# EAGLE design lilygo-surf-v1 (EAGLE 9.6.2)
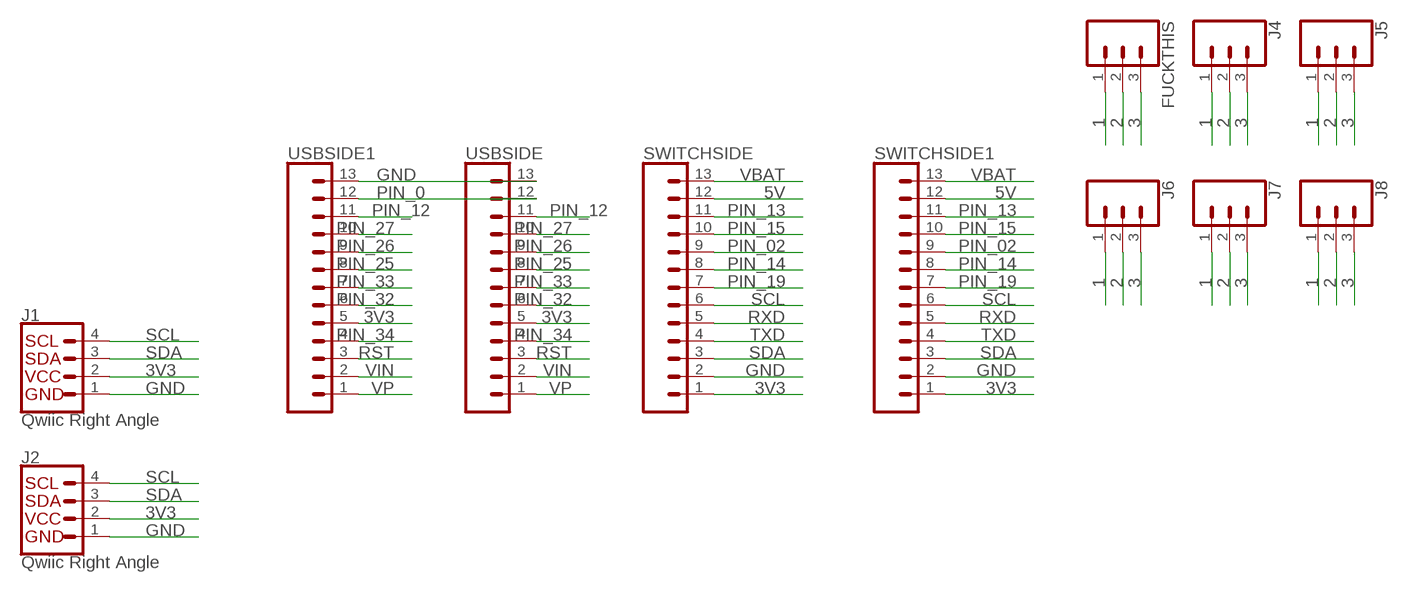
[diagram p0: schematic, sheet 1]

## Parts
FUCKTHIS  CONN_03  [1X03]
J1  Qwiic Right Angle  I2C_STANDARDQWIIC  [1X04_1MM_RA]
J2  Qwiic Right Angle  I2C_STANDARDQWIIC  [1X04_1MM_RA]
J4  CONN_03  [1X03]
J5  CONN_03  [1X03]
J6  CONN_03  [1X03]
J7  CONN_03  [1X03]
J8  CONN_03  [1X03]
SWITCHSIDE  CONN_13LOCK  [1X13_LOCK]
SWITCHSIDE1  CONN_13LOCK  [1X13_LOCK]
USBSIDE  CONN_13LOCK  [1X13_LOCK]
USBSIDE1  CONN_13LOCK  [1X13_LOCK]

## Nets
1: FUCKTHIS.1 J4.1 J5.1 J6.1 J7.1 J8.1
2: FUCKTHIS.2 J4.2 J5.2 J6.2 J7.2 J8.2
3: FUCKTHIS.3 J4.3 J5.3 J6.3 J7.3 J8.3
3V3: J1.2 J2.2 SWITCHSIDE1.1 SWITCHSIDE.1 USBSIDE1.5 USBSIDE.5
5V: SWITCHSIDE1.12 SWITCHSIDE.12
GND: J1.1 J2.1 SWITCHSIDE1.2 SWITCHSIDE.2 USBSIDE1.13 USBSIDE.13
PIN_0: USBSIDE1.12 USBSIDE.12
PIN_02: SWITCHSIDE1.9 SWITCHSIDE.9
PIN_12: USBSIDE1.11 USBSIDE.11
PIN_13: SWITCHSIDE1.11 SWITCHSIDE.11
PIN_14: SWITCHSIDE1.8 SWITCHSIDE.8
PIN_15: SWITCHSIDE1.10 SWITCHSIDE.10
PIN_19: SWITCHSIDE1.7 SWITCHSIDE.7
PIN_25: USBSIDE1.8 USBSIDE.8
PIN_26: USBSIDE1.9 USBSIDE.9
PIN_27: USBSIDE1.10 USBSIDE.10
PIN_32: USBSIDE1.6 USBSIDE.6
PIN_33: USBSIDE1.7 USBSIDE.7
PIN_34: USBSIDE1.4 USBSIDE.4
RST: USBSIDE1.3 USBSIDE.3
RXD: SWITCHSIDE1.5 SWITCHSIDE.5
SCL: J1.4 J2.4 SWITCHSIDE1.6 SWITCHSIDE.6
SDA: J1.3 J2.3 SWITCHSIDE1.3 SWITCHSIDE.3
TXD: SWITCHSIDE1.4 SWITCHSIDE.4
VBAT: SWITCHSIDE1.13 SWITCHSIDE.13
VIN: USBSIDE1.2 USBSIDE.2
VP: USBSIDE1.1 USBSIDE.1

## Library data of the parts
FUCKTHIS J4-J8 = SparkFun-Connectors:CONN_03: Multi connection point. Often used as Generic Header-pin footprint for 0.1 inch spaced/style header connections On any of the 0.1 inch spaced packages, you can populate with these: Break Away Headers - Straight <https://www.sparkfun.com/products/116> (PRT-00116) Break Away Male Headers - Right Angle <https://www.sparkfun.com/products/553> (PRT-00553) Female Headers <https://www.sparkfun.com/products/115> (PRT-00115) Break Away Headers - Machine Pin <https://www.sparkfun.com/products/117> (PRT-00117) Break Away Female Headers - Swiss Machine Pin <https://www.sparkfun.com/products/743> (PRT-00743) Stackable Header - 3 Pin (Female, 0.1") <https://www.sparkfun.com/products/13875> (PRT-13875) For SCREWTERMINALS and SPRING TERMINALS visit here: Screw Terimnals on SparkFun.com <https://www.sparkfun.com/search/results?term=Screw+Terminals> (5mm/3.5mm/2.54mm spacing) This device is also useful as a general connection point to wire up your design to another part of your project. Our various solder wires solder well into these plated through hole pads. Hook-Up Wire - Assortment (Stranded, 22 AWG) <https://www.sparkfun.com/products/11375> (PRT-11375) Hook-Up Wire - Assortment (Solid Core, 22 AWG) <https://www.sparkfun.com/products/11367> (PRT-11367) View the entire wire category on our website here <https://www.sparkfun.com/categories/141> Special notes: Molex polarized connector foot print use with SKU : PRT-08232 with associated crimp pins and housings.
J1 J2 = SparkFun-Connectors:I2C_STANDARD: SparkFun I2C Standard Pinout Header SparkFun has standardized on a pinout for all I2C based sensor breakouts. This pinout allows I2C boards to be plugged directly into the headers on Arduino Uno compatible boards, and to be daisy chained easily. Example SparkFun Products: SparkFun Atmospheric Sensor Breakout - BME280 <https://www.sparkfun.com/products/13676> SparkFun Altitude/Pressure Sensor Breakout - MPL3115A2 <https://www.sparkfun.com/products/11084> SparkFun TOF Range Finder Sensor - VL6180 <https://www.sparkfun.com/products/12785>; PROD_ID: CONN-13729
SWITCHSIDE SWITCHSIDE1 USBSIDE USBSIDE1 = SparkFun-Connectors:CONN_13: Multi connection point. Often used as Generic Header-pin footprint for 0.1 inch spaced/style header connections On any of the 0.1 inch spaced packages, you can populate with these: Break Away Headers - Straight <https://www.sparkfun.com/products/116> (PRT-00116) Break Away Male Headers - Right Angle <https://www.sparkfun.com/products/553> (PRT-00553) Female Headers <https://www.sparkfun.com/products/115> (PRT-00115) Break Away Headers - Machine Pin <https://www.sparkfun.com/products/117> (PRT-00117) Break Away Female Headers - Swiss Machine Pin <https://www.sparkfun.com/products/743> (PRT-00743) For SCREWTERMINALS and SPRING TERMINALS visit here: Screw Terimnals on SparkFun.com <https://www.sparkfun.com/search/results?term=Screw+Terminals> (5mm/3.5mm/2.54mm spacing) This device is also useful as a general connection point to wire up your design to another part of your project. Our various solder wires solder well into these plated through hole pads. Hook-Up Wire - Assortment (Stranded, 22 AWG) <https://www.sparkfun.com/products/11375> (PRT-11375) Hook-Up Wire - Assortment (Solid Core, 22 AWG) <https://www.sparkfun.com/products/11367> (PRT-11367) View the entire wire category on our website here <https://www.sparkfun.com/categories/141> Special notes: Molex polarized connector foot print use with SKU : PRT-08231 with associated crimp pins and housings. 1MM SMD Version SKU: PRT-10208 NOTES ON THE VARIANTS LOCK and LOCK_LONGPADS... This footprint was designed to help hold the alignment of a through-hole component (i.e. 6-pin header) while soldering it into place. You may notice that each hole has been shifted either up or down by 0.005 of an inch from it's more standard position (which is a perfectly straight line). This slight alteration caused the pins (the squares in the middle) to touch the edges of the holes. Because they are alternating, it causes a "brace" to hold the component in place. 0.005 has proven to be the perfect amount of "off-center" position when using our standard breakaway headers. Although looks a little odd when you look at the bare footprint, once you have a header in there, the alteration is very hard to notice. Also,if you push a header all the way into place, it is covered up entirely on the bottom side.

## Board
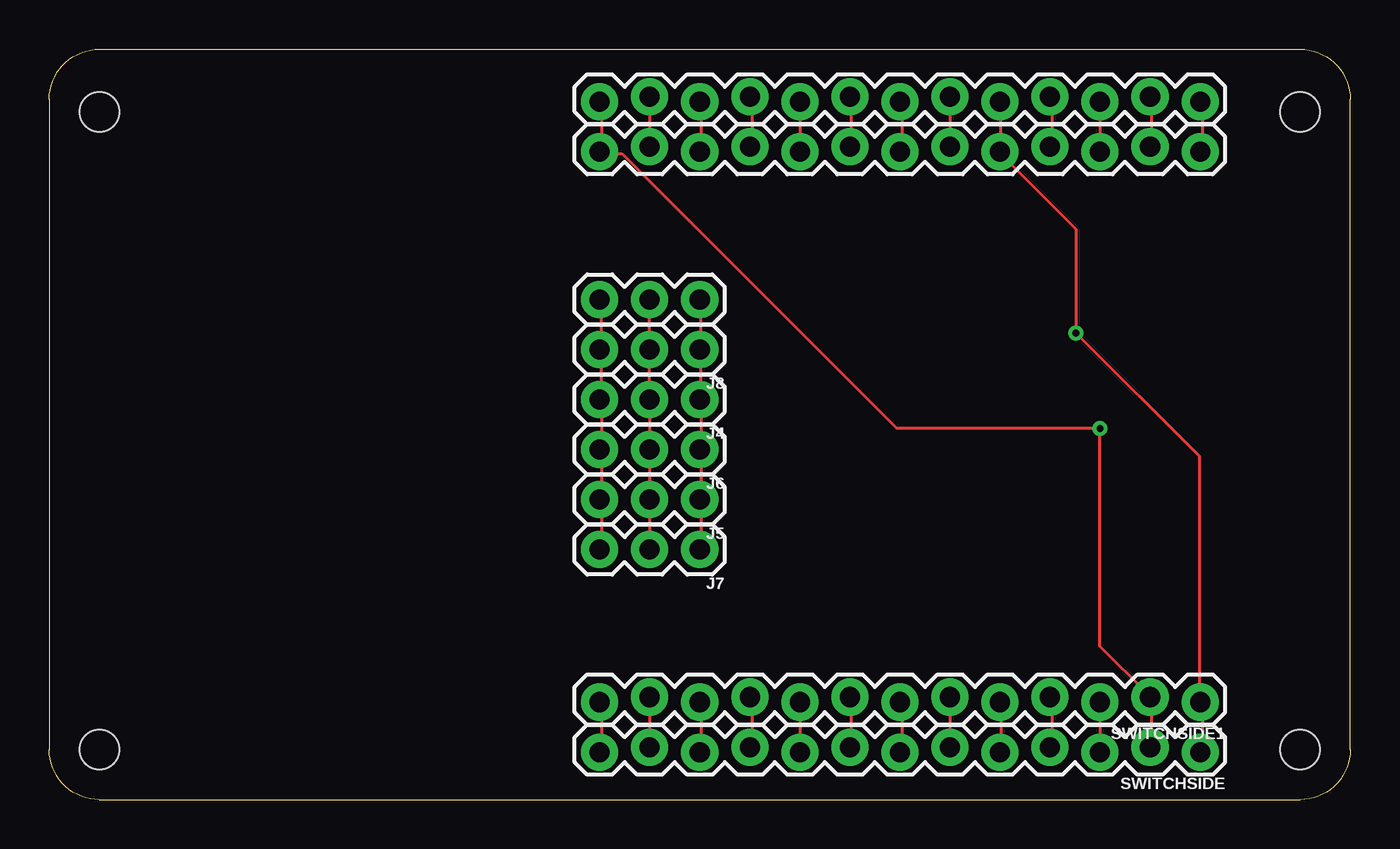
[diagram p1: board, top side]
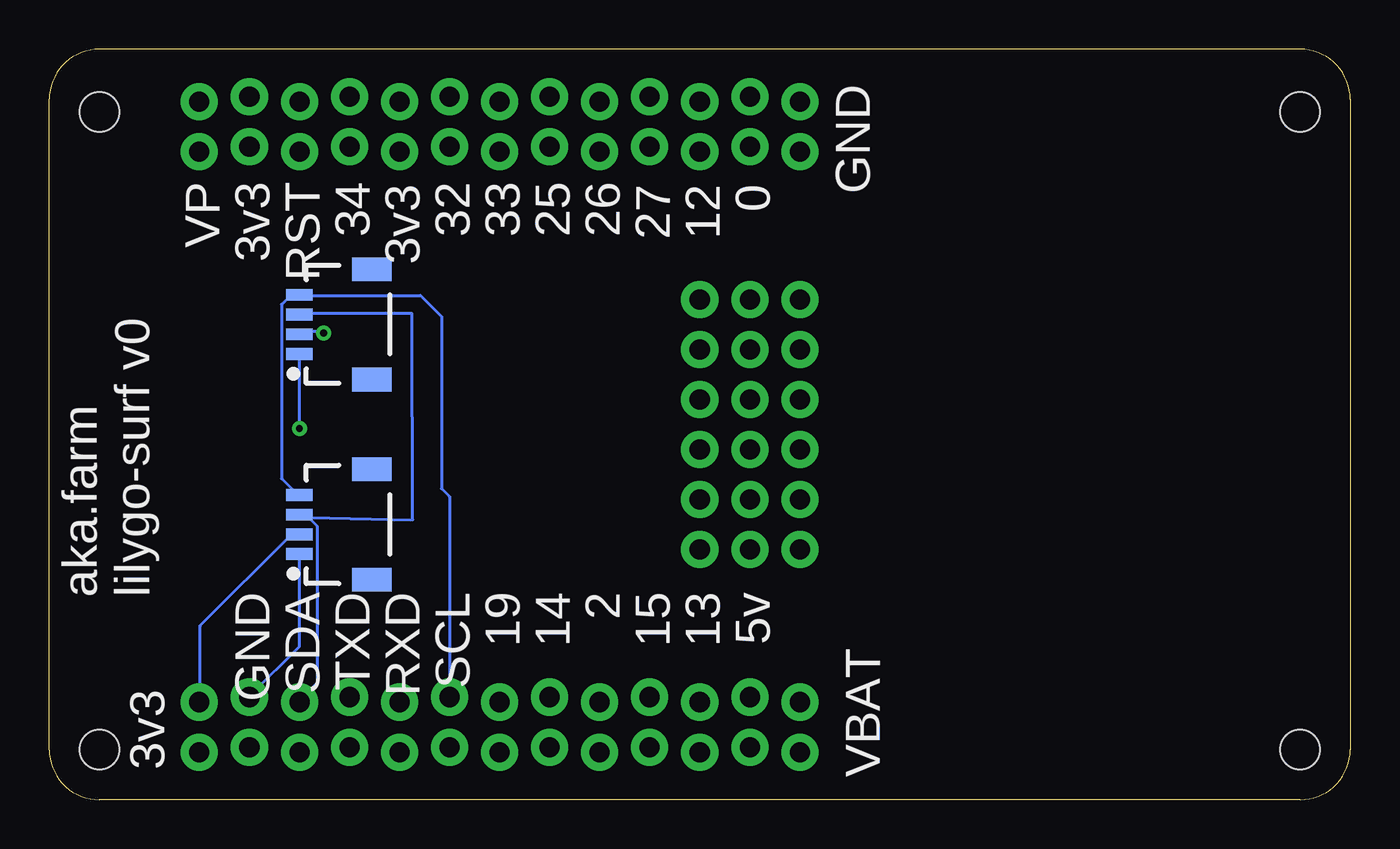
[diagram p2: board, bottom side, seen from below]

Size 66.04 x 38.1 mm. Coordinates in mm from the lower left corner, seen from the top.
Outline: 2.54,0 63.5,0 arc90 66.04,2.54 66.04,35.56 arc90 63.5,38.1 2.54,38.1 arc90 0,35.56 0,2.54 arc90 2.54,0
Copper layers (1*16): Top 0.035mm / dielectric 1.5mm / Bottom 0.035mm
Design rules "default": minimum track width 6mil, minimum drill 0.35mm, track to track 6mil, track to pad 6mil, pad to pad 6mil, via to via 6mil, smd to smd 6mil, copper to edge 40mil, drill to drill 6mil, minimum pad ring 10mil, minimum via ring 8mil, stop-mask expansion 4mil, vias tented up to drill 0mil, thermal gap 10mil
Holes 2 mm at 2.54,2.54 63.5,2.54 63.5,34.92 2.54,34.92

### Footprints (pad centres in the part's own frame; a part is rotated, then mirrored left to right if it is on the bottom)
1X03 = drill 1.016 pad 1.88: 1 0,0; 2 2.54,0; 3 5.08,0
1X04_1MM_RA = smd 0.6 x 1.35: 1 -1.5,0; 2 -0.5,0; 3 0.5,0; 4 1.5,0 | smd 1.2 x 2: NC1 2.8,-3.675; NC2 -2.8,-3.675
1X13_LOCK = drill 1.016 pad 1.88: 1 0,0.127; 2 2.54,-0.127; 3 5.08,0.127; 4 7.62,-0.127; 5 10.16,0.127; 6 12.7,-0.127; 7 15.24,0.127; 8 17.78,-0.127; 9 20.32,0.127; 10 22.86,-0.127; 11 25.4,0.127; 12 27.94,-0.127; 13 30.48,0.127

### Placement (x,y rotation side)
FUCKTHIS  33.02,25.4 180 top
J1  53.34,24.13 90 bottom
J2  53.34,13.97 90 bottom
J4  33.02,20.32 180 top
J5  33.02,15.24 180 top
J6  33.02,17.78 180 top
J7  33.02,12.7 180 top
J8  33.02,22.86 180 top
SWITCHSIDE  58.42,2.54 180 top
SWITCHSIDE1  58.42,5.08 180 top
USBSIDE  58.42,35.56 180 top
USBSIDE1  58.42,33.02 180 top

### Tracks (layer width: path | path; a pad name or v marks a point on that pad's centre or on a via)
1
  Top 0.152: J7.1 33.07,12.75 33.07,15.19 J5.1 33.07,15.34 33.07,17.78 | 33.07,17.78 33.07,20.22 J4.1 33.07,20.37 33.07,22.81 J8.1 33.07,22.96 33.07,25.4 FUCKTHIS.1 | 33.07,17.78 J6.1
2
  Top 0.152: J7.2 J5.2 J6.2 J4.2 J8.2 FUCKTHIS.2
3
  Top 0.152: J7.3 28.04,12.75 28.04,15.19 J5.3 28.04,15.34 28.04,17.78 | 28.04,17.78 28.04,20.22 J4.3 28.04,20.37 28.04,22.81 J8.3 28.04,22.96 28.04,25.4 FUCKTHIS.3 | 28.04,17.78 J6.3
3V3  (via drill 0.35)
  Top 0.152: SWITCHSIDE.1 58.52,2.44 58.52,4.88 SWITCHSIDE1.1 58.37,5.03 58.37,17.45 v52.12,23.7 52.12,28.96 48.31,32.77 USBSIDE1.5 48.31,32.92 48.31,35.36 USBSIDE.5
  Bottom 0.152: J2.2 53.34,13.41 53.8,13.41 58.37,8.84 58.37,5.03 SWITCHSIDE1.1 | v52.12,23.7 52.2,23.77 53.34,23.77 J1.2
5V
  Top 0.152: SWITCHSIDE1.12 SWITCHSIDE.12
GND  (via drill 0.35)
  Top 0.152: USBSIDE.13 28.04,35.36 28.04,32.92 USBSIDE1.13 28.04,32.77 29.11,32.77 43.03,18.85 v53.34,18.85 53.34,7.77 55.78,5.33 SWITCHSIDE1.2 55.93,5.18 55.93,2.74 SWITCHSIDE.2
  Bottom 0.152: J2.1 53.34,7.77 55.78,5.33 SWITCHSIDE1.2 | v53.34,18.85 J1.1
PIN_0
  Top 0.152: USBSIDE.12 USBSIDE1.12
PIN_02
  Top 0.152: SWITCHSIDE1.9 SWITCHSIDE.9
PIN_12
  Top 0.152: USBSIDE1.11 33.07,32.92 33.07,35.36 USBSIDE.11
PIN_13
  Top 0.152: SWITCHSIDE.11 33.07,2.44 33.07,4.88 SWITCHSIDE1.11
PIN_14
  Top 0.152: SWITCHSIDE.8 40.69,2.74 40.69,5.18 SWITCHSIDE1.8
PIN_15
  Top 0.152: SWITCHSIDE.10 35.66,2.74 35.66,5.18 SWITCHSIDE1.10
PIN_19
  Top 0.152: SWITCHSIDE.7 43.28,2.44 43.28,4.88 SWITCHSIDE1.7
PIN_25
  Top 0.152: USBSIDE1.8 40.69,33.22 40.69,35.66 USBSIDE.8
PIN_26
  Top 0.152: USBSIDE.9 USBSIDE1.9
PIN_27
  Top 0.152: USBSIDE1.10 35.66,33.22 35.66,35.66 USBSIDE.10
PIN_32
  Top 0.152: USBSIDE.6 USBSIDE1.6
PIN_33
  Top 0.152: USBSIDE1.7 43.28,32.92 43.28,35.36 USBSIDE.7
PIN_34
  Top 0.152: USBSIDE1.4 50.9,33.22 50.9,35.66 USBSIDE.4
RST
  Top 0.152: USBSIDE.3 USBSIDE1.3
RXD
  Top 0.152: SWITCHSIDE.5 48.31,2.44 48.31,4.88 SWITCHSIDE1.5
SCL
  Top 0.152: SWITCHSIDE1.6 SWITCHSIDE.6
  Bottom 0.152: 53.34,25.6 53.8,25.6 54.25,25.15 54.25,16.31 53.49,15.54 53.34,15.54 J2.4 | SWITCHSIDE1.6 45.72,15.39 46.13,15.8 46.13,24.54 47.19,25.6 53.34,25.6 | 53.34,25.6 J1.4
SDA
  Top 0.152: SWITCHSIDE1.3 SWITCHSIDE.3
  Bottom 0.152: 52.88,14.33 53.34,14.33 J2.3 52.88,14.33 | 52.88,14.33 52.43,13.87 52.43,5.94 53.34,5.03 SWITCHSIDE1.3 | 52.88,14.33 47.59,14.21 47.62,24.69 53.34,24.69 J1.3
TXD
  Top 0.152: SWITCHSIDE.4 50.9,2.74 50.9,5.18 SWITCHSIDE1.4
VBAT
  Top 0.152: SWITCHSIDE.13 28.04,2.44 28.04,4.88 SWITCHSIDE1.13
VIN
  Top 0.152: USBSIDE1.2 55.93,33.22 55.93,35.66 USBSIDE.2
VP
  Top 0.152: USBSIDE1.1 58.52,32.92 58.52,35.36 USBSIDE.1

### Text on the board
bNames: GND | 0 | 12 | 27 | 26 | 25 | 33 | 32 | 3v3 | 34 | RST | 3v3 | VP | 5v | 13 | 15 | 2 | 14 | 19 | SCL | RXD | TXD | SDA | GND | aka.farm / lilygo-surf v0 | 3v3 | VBAT